# Altium schematic sheet ChargingTS.SchDoc
size A4
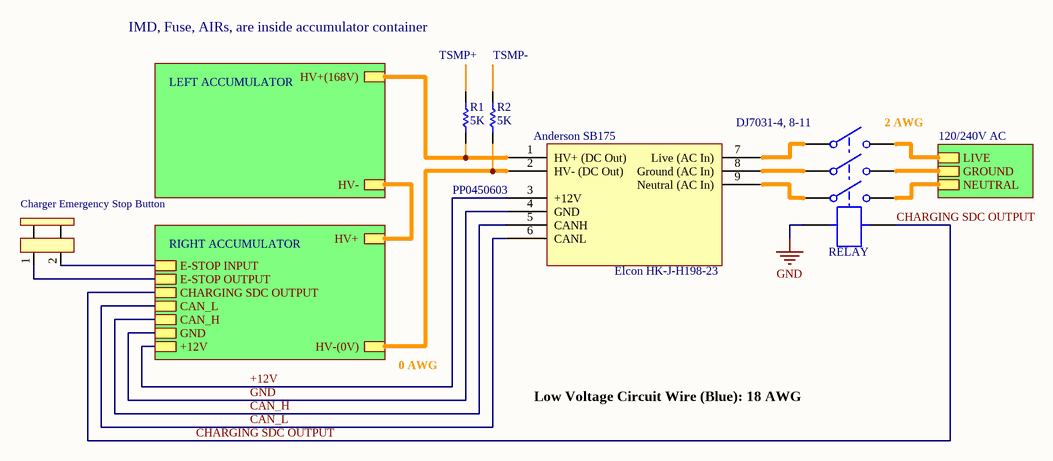
[diagram p0: ChargingTS.SchDoc]

## Parts
11  RELAY
*  SDCbutton  (value not drawn)
?  Elcon HK-J-H198-23
R1  5K
R2  5K

## Sub-sheets
LEFT ACCUMULATOR = File Name: HV+(168V), HV-
RIGHT ACCUMULATOR = File Name: CAN_H, CAN_L, HV-(0V), HV+, +12V, GND, CHARGING SDC OUTPUT, E-STOP INPUT, E-STOP OUTPUT
? = 120/240V AC: LIVE, GROUND, NEUTRAL

## Nets
GND: 11.4 ?.4(GND) ; sheet RIGHT ACCUMULATOR/GND
+12V: ?.3(+12V) ; sheet RIGHT ACCUMULATOR/+12V
CAN_H: ?.5(CANH) ; sheet RIGHT ACCUMULATOR/CAN_H
CAN_L: ?.6(CANL) ; sheet RIGHT ACCUMULATOR/CAN_L
CHARGING SDC OUTPUT: 11.4 ; sheet RIGHT ACCUMULATOR/CHARGING SDC OUTPUT
Net11_4: 11.4 ?.7(Live_(AC_In))
Net11_4: 11.4 ?.8(Ground_(AC_In))  [a separate net that carries the same name]
Net11_4: 11.4 ?.9(Neutral_(AC_In))  [a separate net that carries the same name]
Net11_4: 11.4 ; sheet /NEUTRAL  [a separate net that carries the same name]
Net11_4: 11.4 ; sheet /GROUND  [a separate net that carries the same name]
Net11_4: 11.4 ; sheet /LIVE  [a separate net that carries the same name]
Net*_1: *.1 ; sheet RIGHT ACCUMULATOR/E-STOP OUTPUT
Net*_2: *.2 ; sheet RIGHT ACCUMULATOR/E-STOP INPUT
Net?_1: ?.1(HV+_(DC_Out)) R1.1 ; sheet LEFT ACCUMULATOR/HV+(168V)
Net?_2: ?.2(HV-_(DC_Out)) R2.1 ; sheet RIGHT ACCUMULATOR/HV-(0V)
(unnamed): sheet LEFT ACCUMULATOR/HV-, sheet RIGHT ACCUMULATOR/HV+

Not connected (* = marked no-connect by the designer): R1 2; R2 2

## Notes on the sheet
- IMD, Fuse, AIRs, are inside accumulator container
- TSMP+
- TSMP-
- (near R2) Anderson SB175
- (near 11) DJ7031-4, 8-11
- (near 11) 2 AWG
- PP0450603
- 0 AWG
- Low Voltage Circuit Wire (Blue): 18 AWG
- (in symbol SDCbutton) Charger Emergency Stop Button

## Library data of the parts
? = Charger
R1 R2 = RES